# EAGLE design spi_lcd_booster_dip_v3 (EAGLE 6.1)
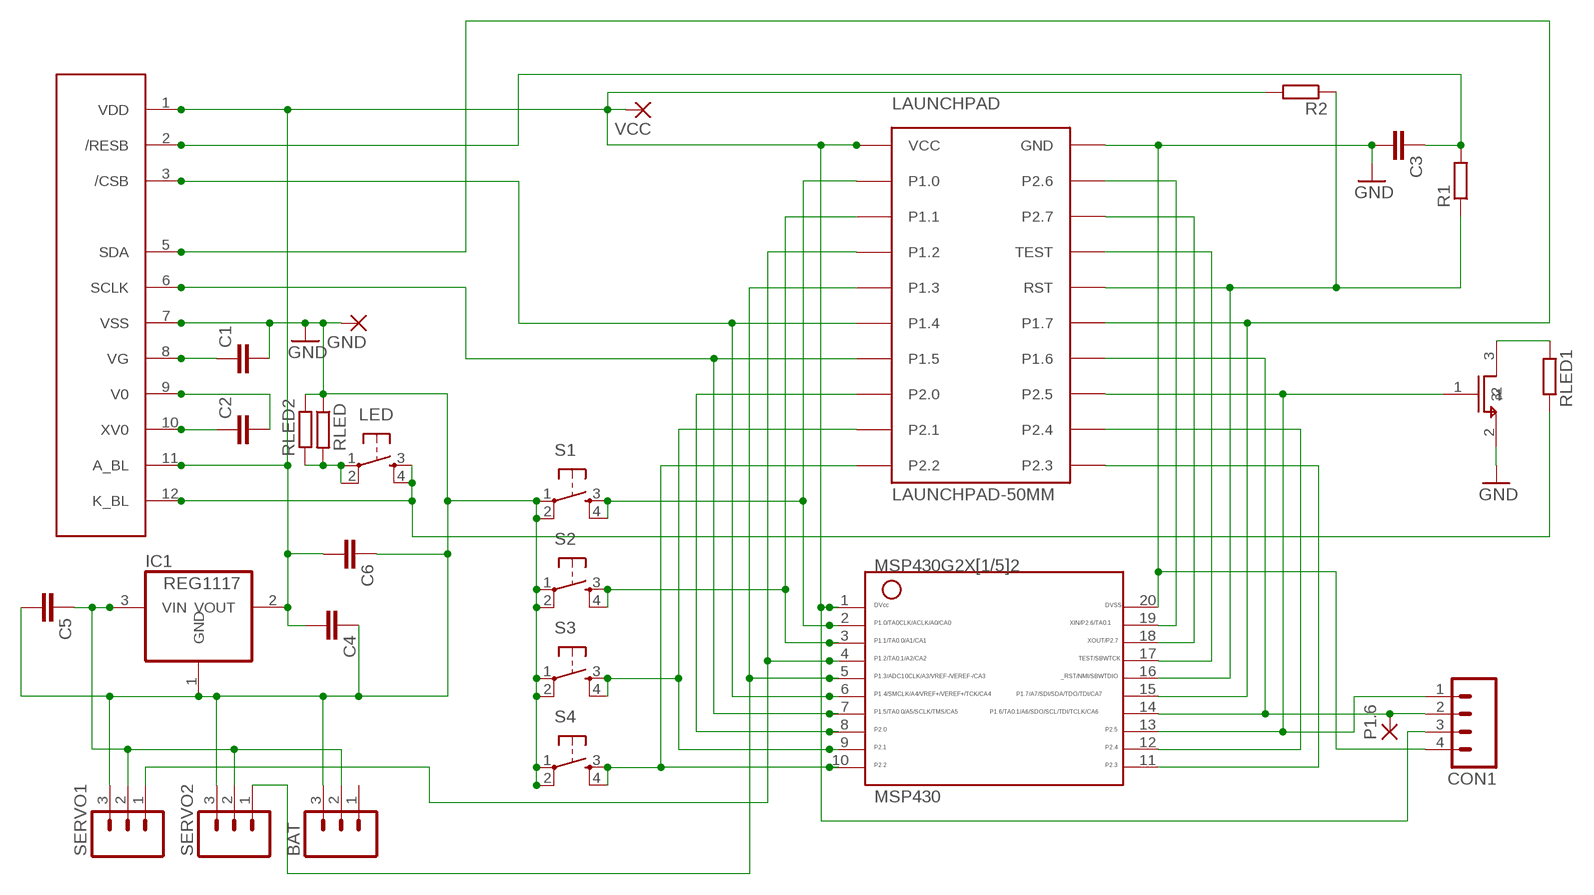
[diagram p0: schematic, sheet 1]

## Parts
BAT  M03PTH  [1X03]
C1  CAP1206  [1206]
C2  CAP1206  [1206]
C3  CAP1206  [1206]
C4  CAP1206  [1206]
C5  CAP1206  [1206]
C6  CAP1206  [1206]
CON1  M04PTH  [1X04]
GND  2,15/1,0  [2,15/1,0]
IC1  REG1117  [SOT223]
LAUNCHPAD  LAUNCHPAD-50MM  [LAUNCHPAD-50MM]
LED  TAC_SWITCHPTH  [TACTILE-PTH]
LEDSW  2N7002PW  [SOT323-R]
MSP430  G2X[1/5]2---N20  [N20]
P1.6  2,15/1,0  [2,15/1,0]
R1  R-EU_R1206  [R1206]
R2  R-EU_R1206  [R1206]
RLED  R-EU_R1206  [R1206]
RLED1  R-EU_R1206  [R1206]
RLED2  R-EU_0207/10  [0207/10]
S1  TAC_SWITCHPTH  [TACTILE-PTH]
S2  TAC_SWITCHPTH  [TACTILE-PTH]
S3  TAC_SWITCHPTH  [TACTILE-PTH]
S4  TAC_SWITCHPTH  [TACTILE-PTH]
SERVO1  M03PTH  [1X03]
SERVO2  M03PTH  [1X03]
U$1  PE9665WRFPE9665WRF-WHOLE  [PE9665WRF]
VCC  2,15/1,0  [2,15/1,0]

## Nets
CSB: LAUNCHPAD.P1.4 MSP430.6 U$1.3(/CSB)
GND: BAT.3 C1.2 C3.2 C4.1 C5.2 C6.1 CON1.4 GND.1(P) IC1.1(GND) LAUNCHPAD.GND LEDSW.2 MSP430.20 RLED2.2 RLED.1 S1.1 S1.2 S2.1 S2.2 S3.1 S3.2 S4.1 S4.2 SERVO1.3 SERVO2.3 U$1.7(VSS)
KBL: LED.3 LED.4 RLED1.2 U$1.12(K_BL)
N$1: C2.1 U$1.10(XV0)
N$2: C2.2 U$1.9(V0)
N$3: C1.1 U$1.8(VG)
N$4: LAUNCHPAD.P2.6 MSP430.19
N$5: C3.1 R1.2 U$1.2(/RESB)
N$6: LAUNCHPAD.P2.7 MSP430.18
N$7: LAUNCHPAD.RST MSP430.16 R1.1 R2.1
N$8: LAUNCHPAD.P1.7 MSP430.15 U$1.5(SDA)
N$9: LEDSW.3 RLED1.1
N$10: LAUNCHPAD.TEST MSP430.17
N$11: LAUNCHPAD.P2.2 MSP430.10 S4.3 S4.4
N$12: CON1.2 LAUNCHPAD.P1.6 MSP430.14 P1.6.1(P)
N$13: CON1.1 LAUNCHPAD.P2.5 LEDSW.1 MSP430.13
N$14: LAUNCHPAD.P2.4 MSP430.12
N$15: LAUNCHPAD.P2.3 MSP430.11
N$20: LAUNCHPAD.P2.1 MSP430.9 S3.3 S3.4
N$21: LAUNCHPAD.P1.5 MSP430.7 U$1.6(SCLK)
N$22: LAUNCHPAD.P2.0 MSP430.8
N$26: LED.1 LED.2 RLED2.1 RLED.2
P1.0: LAUNCHPAD.P1.0 MSP430.2 S1.3 S1.4
P1.1: LAUNCHPAD.P1.1 MSP430.3 S2.3 S2.4
P1.2: LAUNCHPAD.P1.2 MSP430.4 SERVO1.1
P1.3: LAUNCHPAD.P1.3 MSP430.5 SERVO2.1
VBAT: BAT.2 C5.1 IC1.3(VIN) SERVO1.2 SERVO2.2
VDD: C4.2 C6.2 CON1.3 IC1.2(VOUT) LAUNCHPAD.VCC MSP430.1 R2.2 U$1.1(VDD) U$1.11(A_BL) VCC.1(P)
Unconnected: BAT.1

## Library data of the parts
BAT SERVO1 SERVO2 = SparkFun-Connectors:M03: Header 3 Standard 3-pin 0.1" header. Use with straight break away headers (SKU : PRT-00116), right angle break away headers (PRT-00553), swiss pins (PRT-00743), machine pins (PRT-00117), and female headers (PRT-00115). Molex polarized connector foot print use with SKU : PRT-08232 with associated crimp pins and housings.
C1-C6 = SparkFun:CAP: Capacitor Standard 0603 ceramic capacitor, and 0.1" leaded capacitor.
CON1 = SparkFun-Connectors:M04: Header 4 Standard 4-pin 0.1" header. Use with straight break away headers (SKU : PRT-00116), right angle break away headers (PRT-00553), swiss pins (PRT-00743), machine pins (PRT-00117), and female headers (PRT-00115). Molex polarized connector foot print use with SKU : PRT-08231 with associated crimp pins and housings. 1MM SMD Version SKU: PRT-10208
GND P1.6 VCC = wirepad:2,15/1,0: THROUGH-HOLE PAD
IC1 = burr-brown:REG1117: 800mA and 1A Low Dropout (LDO) Positive Regulator 1.8V, 2.5V, 2.85V, 3.3V, 5V, and Adj; MPN: REG1117; OC_FARNELL: 1097566; OC_NEWARK: 14P6981
LAUNCHPAD = TI_launchpad:LAUNCHPAD: MSP-EXP430G2 LaunchPad Booster Pack layouts. LAUNCHPAD: Full-size board LAUNCHPAD-50MM: 50x50mm board covering the button area LAUNCHPAD-50MM-LEFT: 50x50mm board leaving the button area open. Tall LaunchPad components marked on Reference for reference.
LED S1-S4 = SparkFun-Electromechanical:TAC_SWITCH: Momentary Switch Button commonly used for reset or general input. Spark Fun Electronics SKU : COM-00097
LEDSW = apus-spidisplay:2N7002PW
MSP430 = TI_MSP430_v16:G2X[1/5]2---N20: MSP430G2X[1/5]2 MSP430G2x52, MSP430G2x12 PDIP (N) 20 Pin Package http://focus.ti.com/docs/prod/folders/print/msp430g2452.html
R1 R2 RLED RLED1 RLED2 = resistor:R-EU_: RESISTOR, European symbol
U$1 = apus-spidisplay:PE9665WRF

## Board
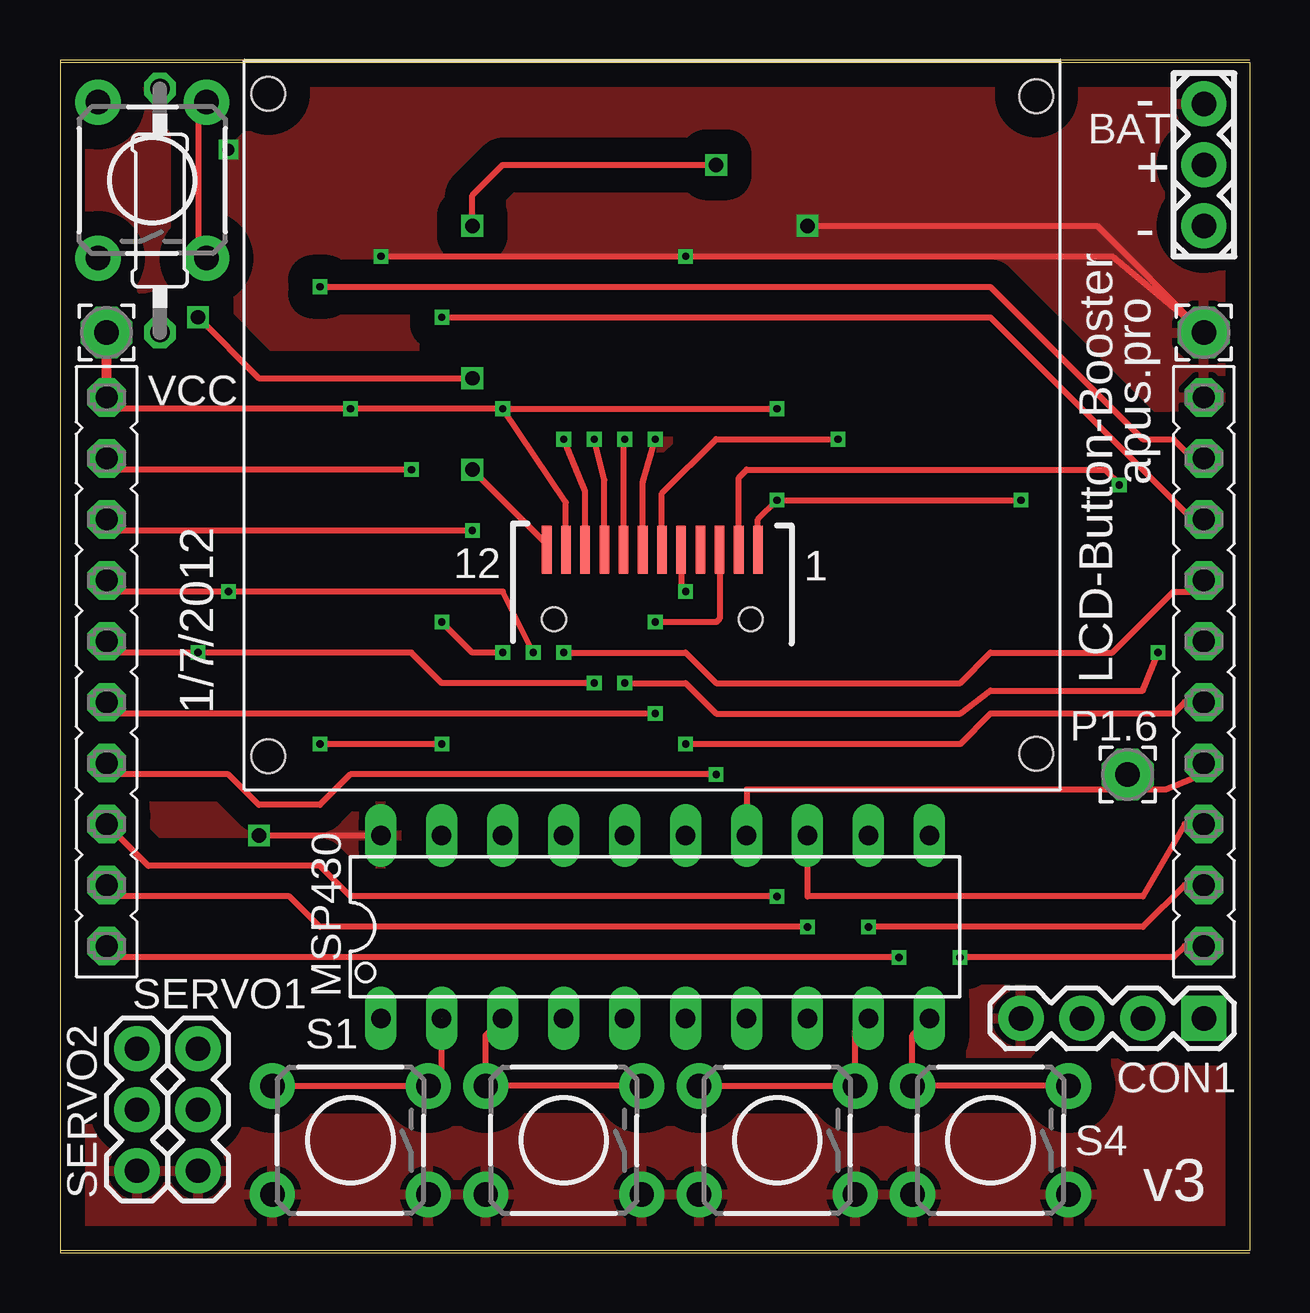
[diagram p1: board, top side]
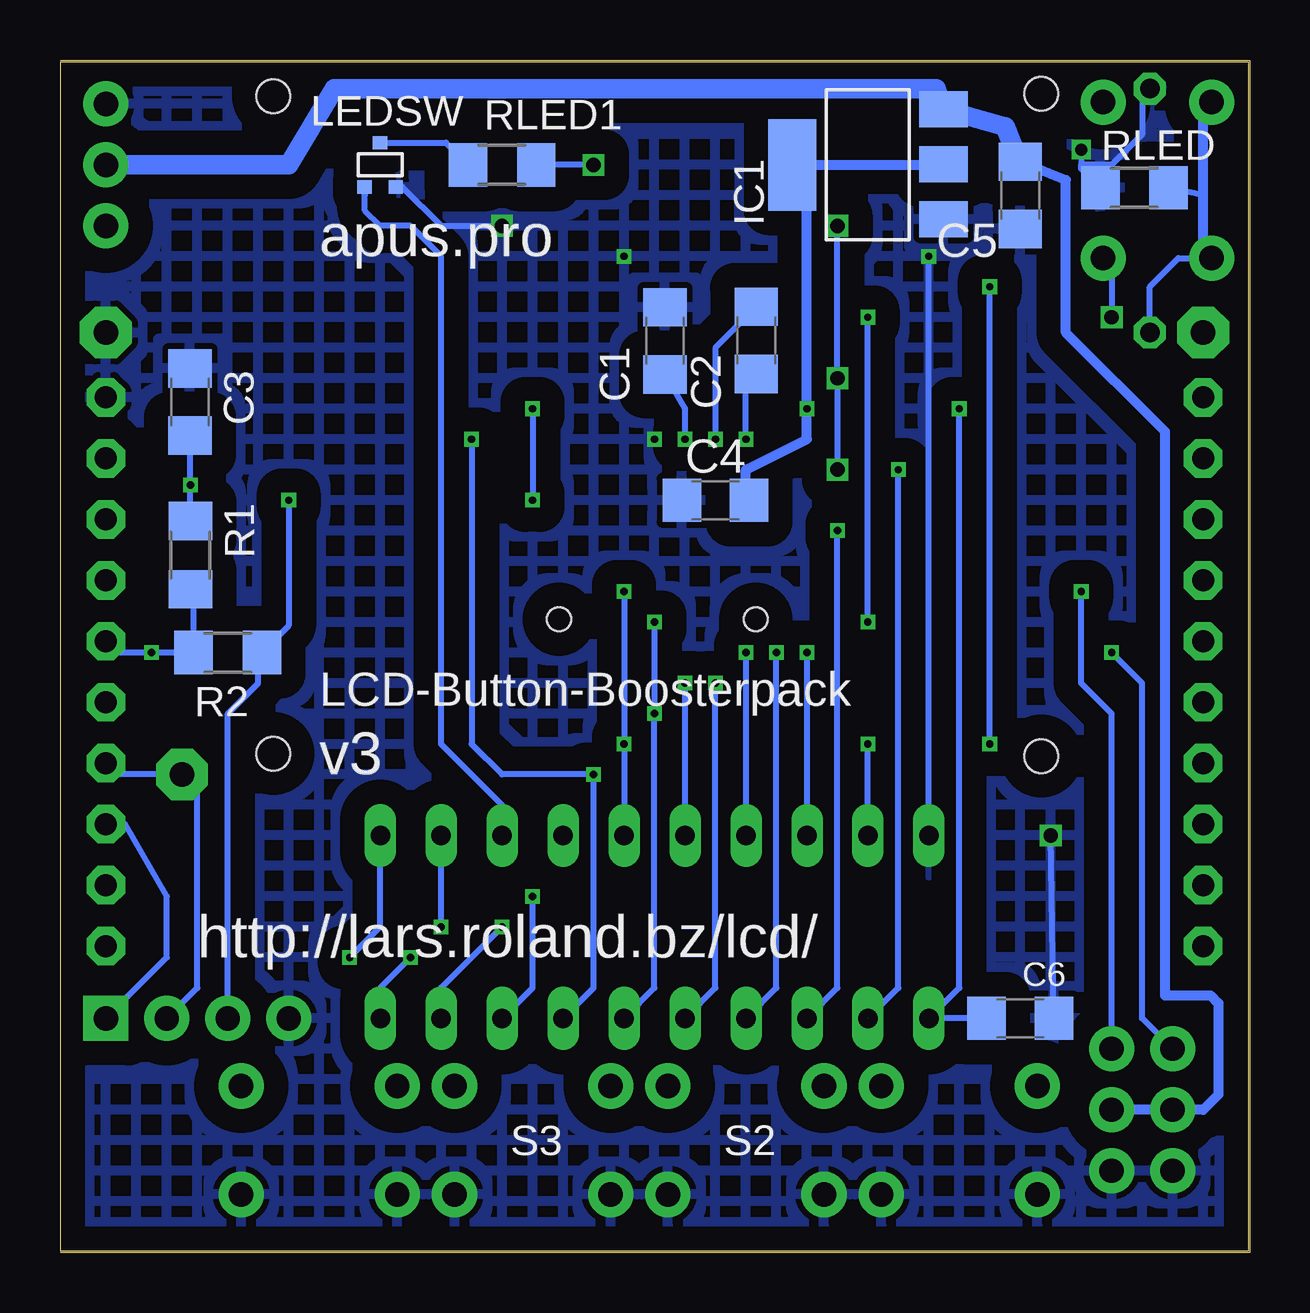
[diagram p2: board, bottom side, seen from below]

Size 49.57 x 49.69 mm. Coordinates in mm from the lower left corner, seen from the top.
Outline: 49.57,0 0,0 0,49.69 49.57,49.69
Copper layers (1*16): Top 0.035mm / dielectric 1.5mm / Bottom 0.035mm
Design rules: minimum track width 6mil, minimum drill 12mil, track to track 6mil, track to pad 6mil, pad to pad 6mil, via to via 6mil, smd to smd 0mil, copper to edge 10mil, drill to drill 10mil, minimum pad ring 10mil, minimum via ring 6mil, stop-mask expansion 2mil, vias tented up to drill 100mil, thermal gap 10mil

### Footprints (pad centres in the part's own frame; a part is rotated, then mirrored left to right if it is on the bottom)
1X03 = drill 1.016 pad 1.88: 1 0,0; 2 2.54,0; 3 5.08,0
1206 = smd 1.6 x 1.8: 1 -1.4,0; 2 1.4,0
1X04 = drill 1.016 pad 1.88 square: 1 0,0 | drill 1.016 pad 1.88: 2 2.54,0; 3 5.08,0; 4 7.62,0
2,15/1,0 = drill 1.016 pad 2.159 octagon: 1 0,0
SOT223 = smd 1.499 x 2.007: 1 -2.261,-3.15; 2 0.025,-3.15; 3 2.311,-3.15 | smd 3.81 x 2.007: 4 0,3.15
LAUNCHPAD-50MM = drill 0.914 pad 1.6 octagon: GND 13.97,48.26; P1.0 16.51,2.54; P1.1 19.05,2.54; P1.2 21.59,2.54; P1.3 24.13,2.54; P1.4 26.67,2.54; P1.5 29.21,2.54; P1.6 29.21,48.26; P1.7 26.67,48.26; P2.0 31.75,2.54; P2.1 34.29,2.54; P2.2 36.83,2.54; P2.3 36.83,48.26; P2.4 34.29,48.26; P2.5 31.75,48.26; P2.6 16.51,48.26; P2.7 19.05,48.26; RST 24.13,48.26; TEST 21.59,48.26; VCC 13.97,2.54
TACTILE-PTH = drill 1.016 pad 1.88: 1 -3.251,2.261; 2 3.251,2.261; 3 -3.251,-2.261; 4 3.251,-2.261
SOT323-R = smd 0.6 x 0.55: 1 -0.65,-0.925; 2 0.65,-0.925; 3 0,0.925
N20 = drill 0.813 long: 1 -11.435,-3.81; 2 -8.895,-3.81; 3 -6.355,-3.81; 4 -3.815,-3.81; 5 -1.275,-3.81; 6 1.265,-3.81; 7 3.805,-3.81; 8 6.345,-3.81; 9 8.885,-3.81; 10 11.425,-3.81; 11 11.425,3.81; 12 8.885,3.81; 13 6.345,3.81; 14 3.805,3.81; 15 1.265,3.81; 16 -1.275,3.81; 17 -3.815,3.81; 18 -6.355,3.81; 19 -8.895,3.81; 20 -11.435,3.81
R1206 = smd 1.6 x 1.803: 1 -1.422,0; 2 1.422,0
0207/10 = drill 0.813 octagon: 1 -5.08,0; 2 5.08,0
PE9665WRF = smd 0.4 x 2: 1 4.4,0; 2 3.6,0; 3 2.8,0; 4 2,0; 5 1.2,0; 6 0.4,0; 7 -0.4,0; 8 -1.2,0; 9 -2,0; 10 -2.8,0; 11 -3.6,0; 12 -4.4,0 | hole 1: -4.1,-2.9; 4.1,-2.9 | hole 1.4: -16,19; 16,18.9; 16,-8.5; -16,-8.6

### Placement (x,y rotation side)
BAT  47.66,42.78 90 top
C1  24.36,37.99 90 bottom
C2  20.56,38.01 90 bottom
C3  44.16,35.44 90 bottom
C4  22.26,31.35 0 bottom
C5  9.56,44.05 270 bottom
C6  9.56,9.76 180 bottom
CON1  47.66,9.76 180 top
GND  47.66,38.34 0 top
IC1  15.91,45.32 90 bottom
LAUNCHPAD  -0.6,49.6 270 top
LED  3.85,44.69 90 top
LEDSW  36.23,45.32 0 bottom
MSP430  24.8,13.57 0 top
P1.6  44.48,19.92 0 top
R1  44.13,29.06 90 bottom
R2  42.58,25 0 bottom
RLED  4.8,44.37 0 bottom
RLED1  31.15,45.32 0 bottom
RLED2  4.16,43.41 90 top
S1  12.1,4.68 180 top
S2  20.99,4.68 180 top
S3  29.88,4.68 180 top
S4  38.77,4.68 180 top
SERVO1  5.75,8.49 270 top
SERVO2  3.21,8.49 270 top
U$1  24.68,29.29 0 top
VCC  1.94,38.34 0 top

### Tracks (layer width: path | path; a pad name or v marks a point on that pad's centre or on a via)
CSB  (via drill 0.3)
  Top 0.254: v24.8,22.46 2.41,22.46 LAUNCHPAD.P1.4 | U$1.3 27.48,26.41 27.34,26.27 v24.8,26.27
  Bottom 0.254: MSP430.6 24.8,11.03 v24.8,22.46 v24.8,26.27
GND  (via drill 0.3, 0.5, 0.6)
  Top 0.254: v13.37,41.51 v26.07,41.51 43.85,41.51 GND.1 | U$1.7 24.28,32.1 v24.8,33.89 | v8.29,17.38 MSP430.20 | v31.15,42.78 43.21,42.78 GND.1 | GND.1 47.66,38.97
  Bottom 0.254: MSP430.20 v13.37,41.51 | RLED.1 7.02,45.17 7.02,45.32 | v7.02,45.95 7.02,45.32 | RLED2.2 4.48,48.18 4.48,46.59 5.75,45.32 7.02,45.32 | C6.1 v8.29,17.38 | LEDSW.2 35.3,44.4 33.69,42.78 v31.15,42.78
  pour Top (isolate 1.016): 0.67,49.13 48.93,49.13 48.93,0.87 0.67,0.87
  pour Bottom (isolate 1.016, hatched): 0.67,49.13 48.93,49.13 48.93,0.87 0.67,0.87
KBL  (via drill 0.6)
  Top 0.254: v5.75,38.97 8.29,36.43 v17.18,36.43 | v17.18,32.62 20.28,29.52 U$1.12 | LED.4 5.75,47.58 5.75,41.51 6.03,41.51 LED.3 | v17.18,42.78 17.18,44.05 18.45,45.32 v27.34,45.32
  Bottom 0.254: LED.3 5.75,41.08 v5.75,38.97 | v17.18,32.62 v17.18,36.43 v17.18,42.78 | v27.34,45.32 RLED1.2
N$1  (via drill 0.3)
  Top 0.254: U$1.10 21.88,31.73 v20.99,33.89
  Bottom 0.254: v20.99,33.89 20.99,36.43 C2.1
N$2  (via drill 0.3)
  Top 0.254: U$1.9 22.68,32.2 v22.26,33.89
  Bottom 0.254: C2.2 22.26,37.7 v22.26,33.89
N$3  (via drill 0.3)
  Top 0.254: U$1.8 23.48,33.84 v23.53,33.89
  Bottom 0.254: C1.1 23.53,35.16 v23.53,33.89
N$4  (via drill 0.3)
  Top 0.254: v15.91,21.19 v10.83,21.19 | v10.83,40.24 38.77,40.24 45.12,33.89 46.39,33.89 47.66,32.62 LAUNCHPAD.P2.6
  Bottom 0.254: MSP430.19 v15.9,21.19 v15.91,21.19 | v10.83,21.19 v10.83,40.24
N$5  (via drill 0.3)
  Top 0.254: U$1.2 28.28,32.29 28.61,32.62 43.53,32.62 44.17,31.98 v44.13,31.98
  Bottom 0.254: R1.2 v44.13,31.98 44.13,34.02 C3.1
N$6  (via drill 0.3)
  Top 0.254: v18.45,25 17.18,25 v15.91,26.27 | v15.91,38.97 38.77,38.97 47.66,30.08 LAUNCHPAD.P2.7
  Bottom 0.254: MSP430.18 v18.45,25 | v15.91,26.27 v15.91,38.97
N$7  (via drill 0.3)
  Top 0.254: v23.53,23.73 26.07,23.73 27.34,22.46 37.5,22.46 38.77,23.41 45.12,23.41 v45.75,25
  Bottom 0.254: R1.1 44,27.51 R2.1 v45.75,25 47.19,25 LAUNCHPAD.RST | MSP430.16 v23.52,23.73 v23.53,23.73
N$8  (via drill 0.3)
  Top 0.254: LAUNCHPAD.P1.7 46.86,22.93 46.39,22.46 38.77,22.46 37.5,21.19 v26.07,21.19 | U$1.5 25.88,27.73 v26.07,27.54
  Bottom 0.254: MSP430.15 v26.07,21.19 v26.07,27.54
N$9
  Bottom 0.254: LEDSW.3 33.5,46.25 RLED1.1
N$10  (via drill 0.3)
  Top 0.254: v20.99,25 26.07,25 27.34,23.73 37.5,23.73 38.77,25 43.85,25 46.39,27.54 47.66,27.54 LAUNCHPAD.TEST
  Bottom 0.254: MSP430.17 v20.98,25 v20.99,25
N$11  (via drill 0.3)
  Top 0.254: v34.96,12.3 1.94,12.3 LAUNCHPAD.P2.2 | S4.3 S4.4 35.52,9.05 MSP430.10
  Bottom 0.254: MSP430.10 36.23,11.04 v34.96,12.3
N$12
  Top 0.254: LAUNCHPAD.P1.6 47.66,19.92 46.07,19.29 28.6,19.29 MSP430.14
  Bottom 0.254: LAUNCHPAD.P1.6 47.66,19.92 P1.6.1 43.85,19.29 43.85,11.03 CON1.2
N$13
  Top 0.254: LAUNCHPAD.P2.5 46.86,17.85 45.12,14.84 31.15,14.84 MSP430.13
  Bottom 0.254: CON1.1 45.12,12.3 45.12,14.84 46.86,17.85 LAUNCHPAD.P2.5 | MSP430.13 31.14,18.65 33.69,21.19 33.69,41.51 34.96,42.78 36.23,42.78 36.87,43.41 36.87,44.05 | 36.87,44.05 36.87,44.37 | LEDSW.1 36.88,44.07 36.87,44.05
N$14  (via drill 0.3)
  Top 0.254: LAUNCHPAD.P2.4 46.86,15.31 45.12,13.57 v33.69,13.57
  Bottom 0.254: v33.69,13.57 MSP430.12
N$15  (via drill 0.3)
  Top 0.254: LAUNCHPAD.P2.3 46.86,12.77 46.39,12.3 v37.5,12.3
  Bottom 0.254: v37.5,12.3 36.23,13.57 MSP430.11
N$20  (via drill 0.3)
  Top 0.254: v31.15,13.57 10.83,13.57 9.56,14.84 2.41,14.84 LAUNCHPAD.P2.1 | S3.4 S3.3 33.13,9.21 MSP430.9
  Bottom 0.254: MSP430.9 33.68,11.04 v31.15,13.57
N$21  (via drill 0.3)
  Top 0.254: v27.34,19.92 12.1,19.92 10.83,18.65 8.29,18.65 7.02,19.92 2.41,19.92 LAUNCHPAD.P1.5 | U$1.6 25.08,31.63 27.34,33.89 v32.42,33.89
  Bottom 0.254: MSP430.7 27.34,11.03 v27.34,19.92 31.15,19.92 32.42,21.19 v32.42,33.89
N$22  (via drill 0.3)
  Top 0.254: v29.88,14.84 12.1,14.84 10.83,16.11 3.68,16.11 LAUNCHPAD.P2.0
  Bottom 0.254: MSP430.8 29.88,11.03 v29.88,14.84
N$26
  Bottom 0.254: 1.94,44.05 RLED.2 | RLED2.1 4.16,40.24 2.97,41.43 LED.1
  Bottom 0.406: LED.1 1.94,41.79 1.94,44.05 1.94,47.86 1.66,47.86 LED.2
P1.0  (via drill 0.3)  (1 unrouted)
  Top 0.254: v14.64,32.62 2.41,32.62 LAUNCHPAD.P1.0 | S1.4 S1.3 15.63,6.94 15.91,7.22 MSP430.2
  Bottom 0.254: MSP430.2 14.64,11.03 v14.64,32.62
P1.1  (via drill 0.3)
  Top 0.254: v17.18,30.08 2.41,30.08 LAUNCHPAD.P1.1 | MSP430.3 17.74,9.05 S2.4 S2.3
  Bottom 0.254: MSP430.3 17.18,11.03 v17.18,30.08
P1.2  (via drill 0.3)
  Top 0.254: v19.72,25 18.45,27.54 v7.02,27.54 2.41,27.54 LAUNCHPAD.P1.2
  Bottom 0.254: MSP430.4 19.72,11.03 v19.72,25 | SERVO1.1 5.75,22.46 7.02,23.73 v7.02,27.54
P1.3  (via drill 0.3)
  Top 0.254: v22.26,23.73 15.91,23.73 14.64,25 v5.75,25 2.41,25 LAUNCHPAD.P1.3
  Bottom 0.254: MSP430.5 22.26,11.03 v22.26,23.73 | SERVO2.1 4.48,9.76 4.48,23.73 v5.75,25
VBAT
  Bottom 0.406: SERVO1.2 SERVO2.2 1.94,5.95 1.31,6.58 1.31,10.39 1.62,10.71 3.53,10.71 3.53,34.21 7.66,38.34 7.66,44.69 C5.1
  Bottom 0.813: BAT.2 40.04,45.32 38.13,48.5 13.05,48.5 IC1.3 10.2,46.91 9.56,45.32 C5.1
VDD  (via drill 0.3)
  Top 0.254: LAUNCHPAD.VCC 1.94,35.16 v12.1,35.16 v18.45,35.16 | v18.45,35.16 v29.88,35.16 | U$1.1 29.08,30.55 v29.88,31.35 v40.04,31.35 | U$1.11 21.08,31.26 v18.45,35.16
  Top 0.406: LAUNCHPAD.VCC VCC.1
  Bottom 0.254: MSP430.1 12.1,11.03 v12.1,35.16 | v29.88,35.16 v29.88,31.35 | v40.04,31.35 40.04,26.12 R2.2 41.31,24.85 41.31,23.73 42.58,22.46 CON1.3 | C6.2 MSP430.1 | MSP430.1 | 12.1,45.32 IC1.2 13.37,45.32
  Bottom 0.406: C4.2 20.99,31.35 20.99,32.62 18.45,33.89 v18.45,35.16 18.45,45.32 13.37,45.32

### Text on the board
tPlace: - | + | - | apus.pro | LCD-Button-Booster | 1/7/2012 | v3
bPlace: apus.pro | LCD-Button-Boosterpack | v3 | http://lars.roland.bz/lcd/